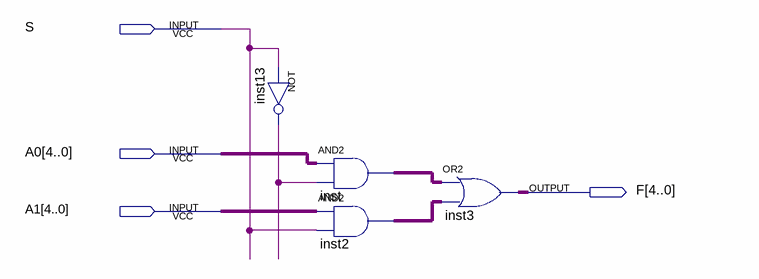
[diagram p0: schematic sheet]
// Quartus schematic mux_2X1_5bits.bdf as structural Verilog: 4 symbols, 4 pins
module mux_2X1_5bits (
  input  S,
  input  [4:0] A0,
  input  [4:0] A1,
  output [4:0] F
);

  wire inst13_out;
  wire [4:0] inst2_out, inst_out;

  not inst13 (inst13_out, S);
  assign inst_out = A0 & {5{inst13_out}};  // AND2 inst, 5 bits wide
  assign inst2_out = A1 & {5{S}};  // AND2 inst2, 5 bits wide
  assign F = inst_out | inst2_out;  // OR2 inst3, 5 bits wide
endmodule
